# Altium project EMG_shield_fullydiff.PrjPcb
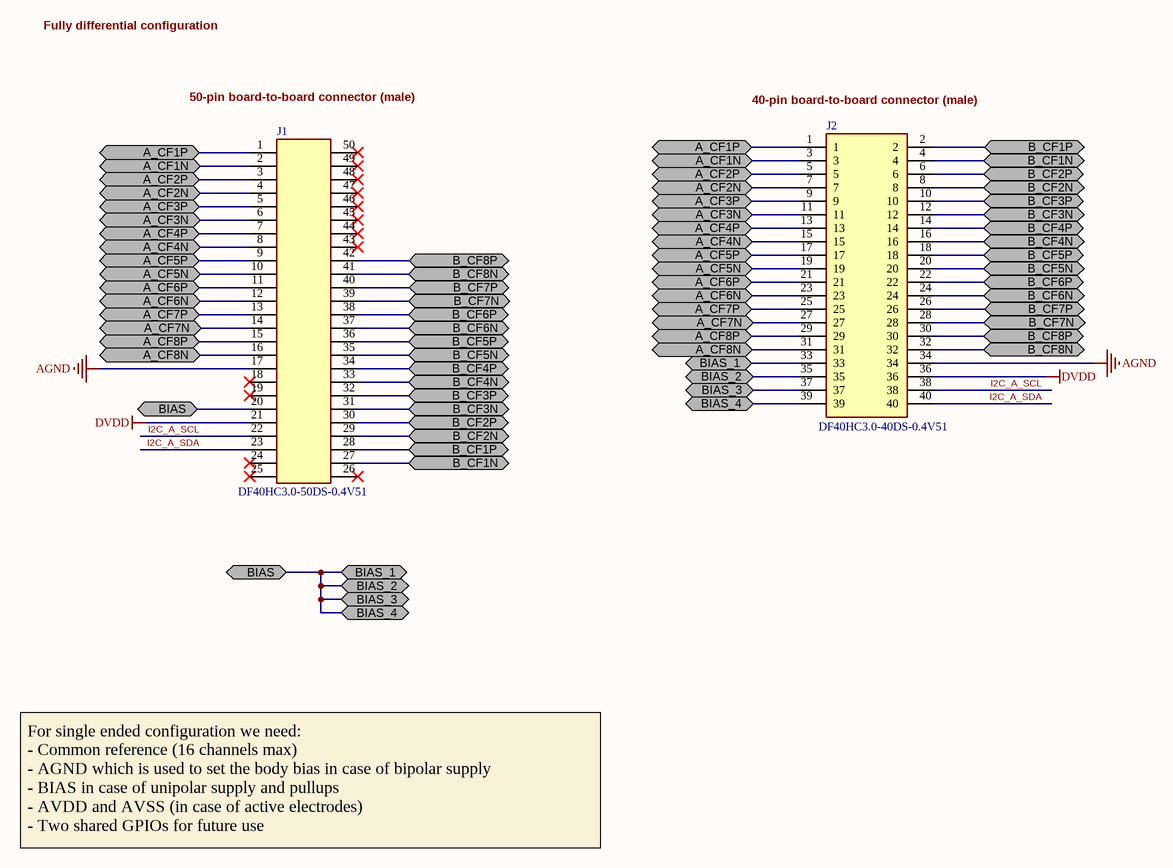
[diagram p0: 01_fullydiff_config.SchDoc]
revision: v2.0; title: BioGAP EMG shield
1 sheet, 2 parts. Net scope: flat (ports and power ports of the same name join across sheets).
Board file: EMG_shield_fullydiff.PcbDoc

## Sheet 01_fullydiff_config.SchDoc: BioGAP EMG shield
size A3

### Parts
J1  DF40HC3.0-50DS-0.4V51  [CONN_DF40HC3.0-50DS-0.4V51_HIR]
J2  DF40HC3.0-40DS-0.4V51  [CONN40_DF40HC-40DS_HIR]

### Ports
A_CF1N (bidir), A_CF1P (bidir), A_CF2N (bidir), A_CF2P (bidir), A_CF3N (bidir), A_CF3P (bidir), A_CF4N (bidir), A_CF4P (bidir), A_CF5N (bidir), A_CF5P (bidir), A_CF6N (bidir), A_CF6P (bidir), A_CF7N (bidir), A_CF7P (bidir), A_CF8N (bidir), A_CF8P (bidir), B_CF1N (bidir), B_CF1P (bidir), B_CF2N (bidir), B_CF2P (bidir), B_CF3N (bidir), B_CF3P (bidir), B_CF4N (bidir), B_CF4P (bidir), B_CF5N (bidir), B_CF5P (bidir), B_CF6N (bidir), B_CF6P (bidir), B_CF7N (bidir), B_CF7P (bidir), B_CF8N (bidir), B_CF8P (bidir), BIAS (bidir), BIAS_1 (bidir), BIAS_2 (bidir), BIAS_3 (bidir), BIAS_4 (bidir)

### Nets
AGND: J1.17 J2.34
DVDD: J1.21 J2.36
I2C_A_SCL: J1.22 J2.38
I2C_A_SDA: J1.23 J2.40
NetJ1_1: J1.1 J2.1 ; port A_CF1P
NetJ1_2: J1.2 J2.3 ; port A_CF1N
NetJ1_3: J1.3 J2.5 ; port A_CF2P
NetJ1_4: J1.4 J2.7 ; port A_CF2N
NetJ1_5: J1.5 J2.9 ; port A_CF3P
NetJ1_6: J1.6 J2.11 ; port A_CF3N
NetJ1_7: J1.7 J2.13 ; port A_CF4P
NetJ1_8: J1.8 J2.15 ; port A_CF4N
NetJ1_9: J1.9 J2.17 ; port A_CF5P
NetJ1_10: J1.10 J2.19 ; port A_CF5N
NetJ1_11: J1.11 J2.21 ; port A_CF6P
NetJ1_12: J1.12 J2.23 ; port A_CF6N
NetJ1_13: J1.13 J2.25 ; port A_CF7P
NetJ1_14: J1.14 J2.27 ; port A_CF7N
NetJ1_15: J1.15 J2.29 ; port A_CF8P
NetJ1_16: J1.16 J2.31 ; port A_CF8N
NetJ1_20: J1.20 J2.33 J2.35 J2.37 J2.39 ; port BIAS, port BIAS_1, port BIAS_2, port BIAS_3, port BIAS_4
NetJ1_27: J1.27 J2.4 ; port B_CF1N
NetJ1_28: J1.28 J2.2 ; port B_CF1P
NetJ1_29: J1.29 J2.8 ; port B_CF2N
NetJ1_30: J1.30 J2.6 ; port B_CF2P
NetJ1_31: J1.31 J2.12 ; port B_CF3N
NetJ1_32: J1.32 J2.10 ; port B_CF3P
NetJ1_33: J1.33 J2.16 ; port B_CF4N
NetJ1_34: J1.34 J2.14 ; port B_CF4P
NetJ1_35: J1.35 J2.20 ; port B_CF5N
NetJ1_36: J1.36 J2.18 ; port B_CF5P
NetJ1_37: J1.37 J2.24 ; port B_CF6N
NetJ1_38: J1.38 J2.22 ; port B_CF6P
NetJ1_39: J1.39 J2.28 ; port B_CF7N
NetJ1_40: J1.40 J2.26 ; port B_CF7P
NetJ1_41: J1.41 J2.32 ; port B_CF8N
NetJ1_42: J1.42 J2.30 ; port B_CF8P

Not connected (* = marked no-connect by the designer): J1 18* 19* 24* 25* 26* 43* 44* 45* 46* 47* 48* 49* 50*

### Notes on the sheet
- Fully differential configuration
- (near J1) 50-pin board-to-board connector (male)
- (near J2) 40-pin board-to-board connector (male)
- For single ended configuration we need:
  - Common reference (16 channels max)
  - AGND which is used to set the body bias in case of bipolar supply
  - BIAS in case of unipolar supply and pullups
  - AVDD and AVSS (in case of active electrodes)
  - Two shared GPIOs for future use
- 1
- 2
- 3
- 4
- 5
- 6
- 7
- 8
- A
- B
- C
- D
- Project:
- Date:
- Drawing number:
- Rev:
- Format:
- A3
- Drawn by:
- Laboratory:
- Page
- Sheet:
- of
- File:

### Library data of the parts
J1 = DF40HC3.0-50DS-0.4V51: No Description Available; Mfr_Name: Hirose; RefDes: RefDes; Type: Type
J2 = DF40HC3.0-40DS-0.4V51: No Description Available; Mfr_Name: Hirose; Type: Arrays, Edge Type, Mezzanine (Board to Board); RefDes: RefDes

## Assembly variants
Unipolar_supply: all parts fitted
Bipolar_supply: all parts fitted